# Altium schematic sheet [26] - PWR PMIC.SchDoc
size A2; DocumentNumber: 26; SheetNumber: 26; SheetTotal: 31
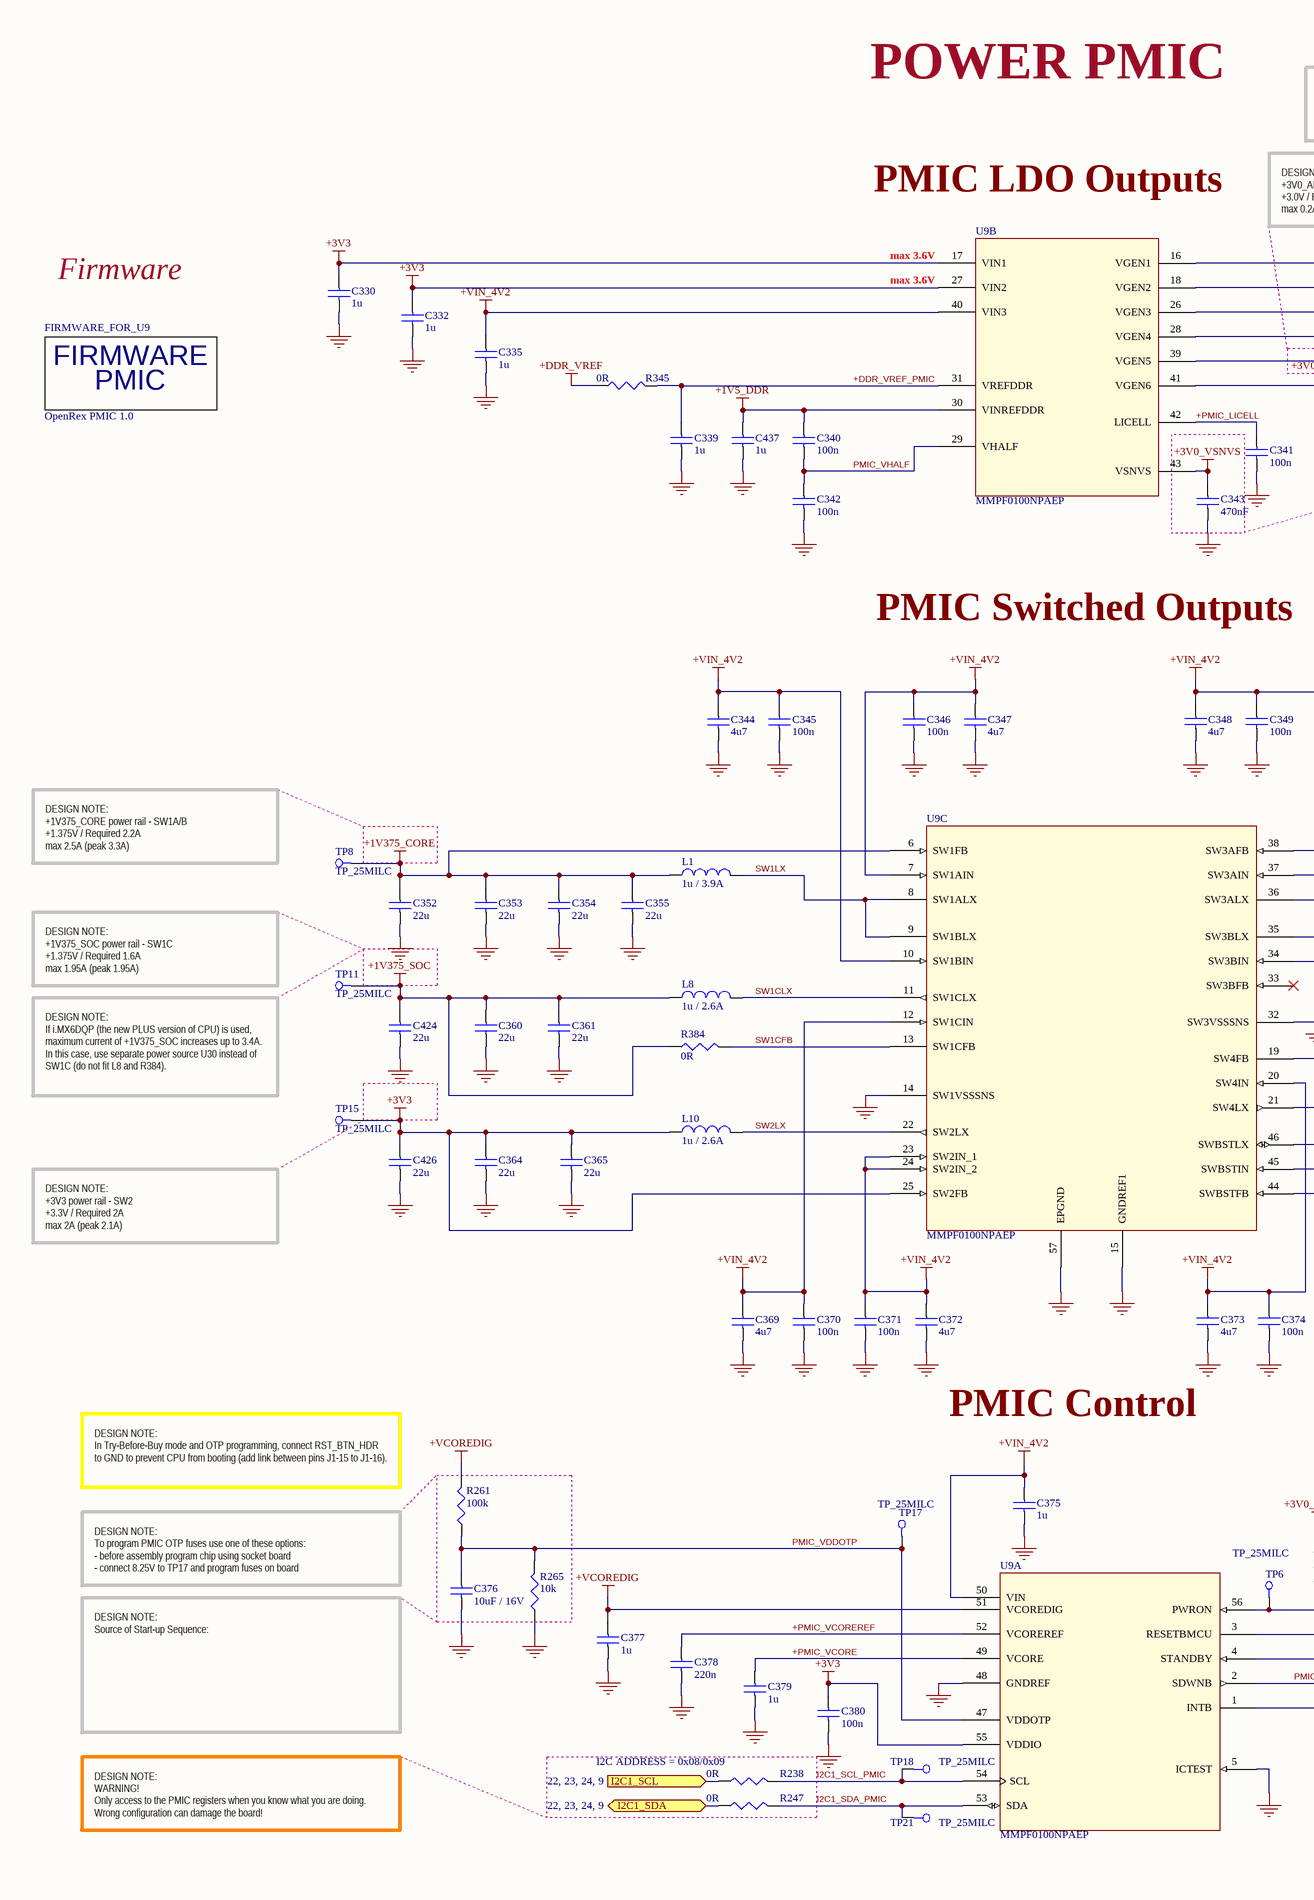
[diagram p0: [26] - PWR PMIC.SchDoc, left]
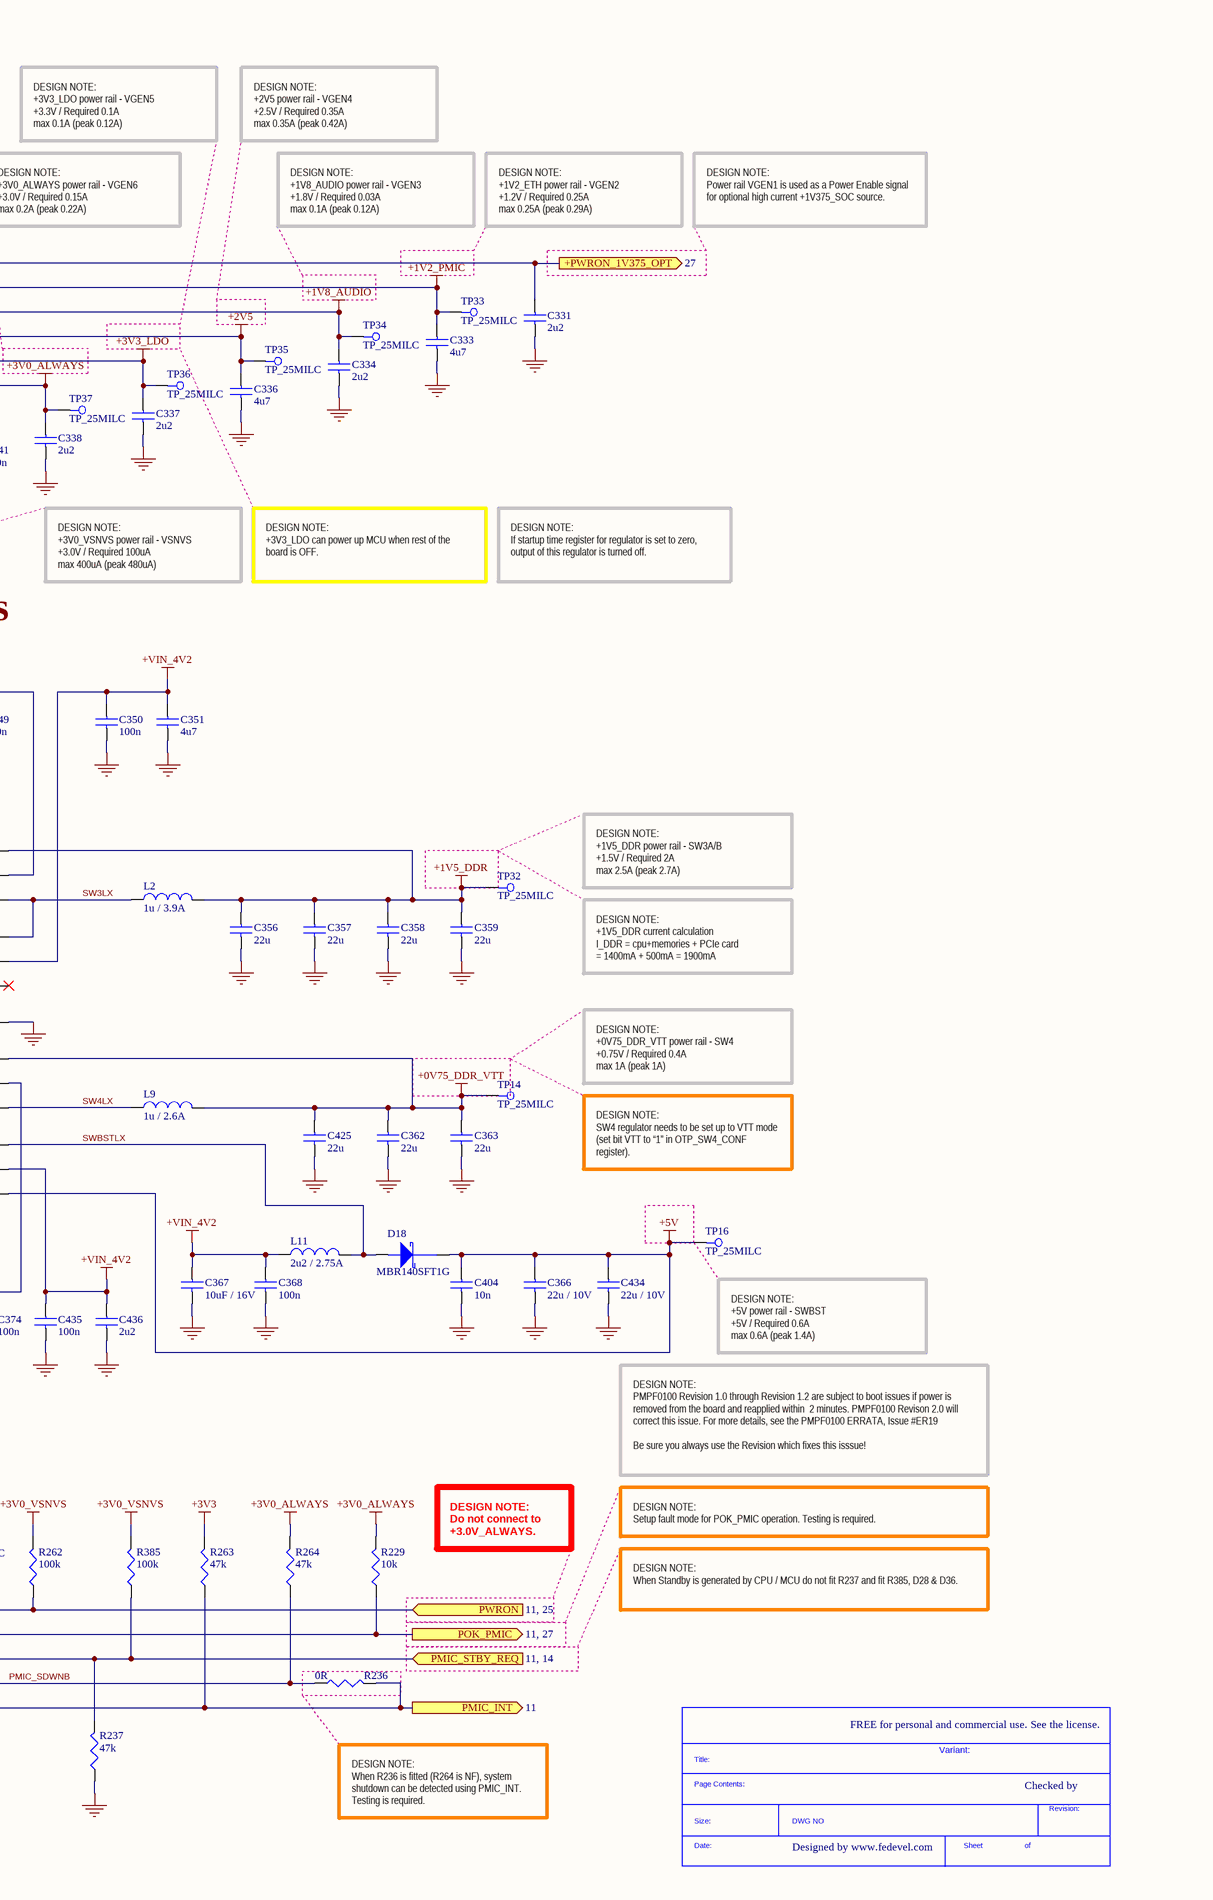
[diagram p1: [26] - PWR PMIC.SchDoc, right]

## Parts
*  SDTitleBlock  (value not drawn)  (graphical)
C330  1u  [C0402]
C331  2u2  [C0402]
C332  1u  [C0402]
C333  4u7  [C0402]
C334  2u2  [C0402]
C335  1u  [C0402]
C336  4u7  [C0402]
C337  2u2  [C0402]
C338  2u2  [C0402]
C339  1u  [C0402]
C340  100n  [C0402]
C341  100n  [C0402]
C342  100n  [C0402]
C343  470nF  [C0402]
C344  4u7  [C0402]
C345  100n  [C0402]
C346  100n  [C0402]
C347  4u7  [C0402]
C348  4u7  [C0402]
C349  100n  [C0402]
C350  100n  [C0402]
C351  4u7  [C0402]
C352  22u  [C0603]
C353  22u  [C0603]
C354  22u  [C0603]
C355  22u  [C0603]
C356  22u  [C0603]
C357  22u  [C0603]
C358  22u  [C0603]
C359  22u  [C0603]
C360  22u  [C0603]
C361  22u  [C0603]
C362  22u  [C0603]
C363  22u  [C0603]
C364  22u  [C0603]
C365  22u  [C0603]
C366  22u / 10V  [C0603]
C367  10uF / 16V  [C0805]
C368  100n  [C0402]
C369  4u7  [C0402]
C370  100n  [C0402]
C371  100n  [C0402]
C372  4u7  [C0402]
C373  4u7  [C0402]
C374  100n  [C0402]
C375  1u  [C0402]
C376  10uF / 16V  [C0805]
C377  1u  [C0402]
C378  220n  [C0402]
C379  1u  [C0402]
C380  100n  [C0402]
C404  10n  [C0402]
C424  22u  [C0603]
C425  22u  [C0603]
C426  22u  [C0603]
C434  22u / 10V  [C0603]
C435  100n  [C0402]
C436  2u2  [C0402]
C437  1u  [C0402]
D18  MBR140SFT1G  [SOD-123FL]
FIRMWARE_FOR_U9  OpenRex PMIC 1.0  (mechanical)
L1  1u / 3.9A  [IHLP_118MILX144MIL]
L2  1u / 3.9A  [IHLP_118MILX144MIL]
L8  1u / 2.6A  [IFSC_79MILX98MIL]
L9  1u / 2.6A  [IFSC_79MILX98MIL]
L10  1u / 2.6A  [IFSC_79MILX98MIL]
L11  2u2 / 2.75A  [IHLP_160MILX175MIL]
R229  10k  [R0402]
R236  0R  [R0402]
R237  47k  [R0402]
R238  0R  [R0402]
R247  0R  [R0402]
R261  100k  [R0402]
R262  100k  [R0402]
R263  47k  [R0402]
R264  47k  [R0402]
R265  10k  [R0402]
R345  0R  [R0402]
R384  0R  [R0402]
R385  100k  [R0402]
TP6  TP_25MILC  [TP_25C]  (no BOM)
TP8  TP_25MILC  [TP_25C]  (no BOM)
TP11  TP_25MILC  [TP_25C]  (no BOM)
TP14  TP_25MILC  [TP_25C]  (no BOM)
TP15  TP_25MILC  [TP_25C]  (no BOM)
TP16  TP_25MILC  [TP_25C]  (no BOM)
TP17  TP_25MILC  [TP_25C]  (no BOM)
TP18  TP_25MILC  [TP_25C]  (no BOM)
TP21  TP_25MILC  [TP_25C]  (no BOM)
TP32  TP_25MILC  [TP_25C]  (no BOM)
TP33  TP_25MILC  [TP_25C]  (no BOM)
TP34  TP_25MILC  [TP_25C]  (no BOM)
TP35  TP_25MILC  [TP_25C]  (no BOM)
TP36  TP_25MILC  [TP_25C]  (no BOM)
TP37  TP_25MILC  [TP_25C]  (no BOM)
U9  MMPF0100NPAEP  [56-VFQFN EP]  (parts A,B,C of 3)

## Blocks framed on the sheet
I2C ADDRESS = 0x08/0x09: R238 R247

## Ports
+PWRON_1V375_OPT (see 27), I2C1_SCL (see 22, 23, 24, 9), I2C1_SDA (bidir, see 22, 23, 24, 9), PMIC_INT (out, see 11), PMIC_STBY_REQ (in, see 11, 14), POK_PMIC (see 11, 27), PWRON (in, see 11, 25)

## Nets
+0V75_DDR_VTT: C362.1 C363.1 C425.1 L9.2 TP14.1 U9.19(SW4FB)
+1V2_PMIC: C333.1 TP33.1 U9.18(VGEN2)
+1V5_DDR: C340.1 C356.1 C357.1 C358.1 C359.1 C437.1 L2.2 TP32.1 U9.30(VINREFDDR) U9.38(SW3AFB)
+1V8_AUDIO: C334.1 TP34.1 U9.26(VGEN3)
+1V375_CORE: C352.1 C353.1 C354.1 C355.1 L1.2 TP8.1 U9.6(SW1FB)
+1V375_SOC: C360.1 C361.1 C424.1 L8.1 R384.1 TP11.1
+2V5: C336.1 TP35.1 U9.28(VGEN4)
+3V0_ALWAYS: C338.1 R229.2 R264.2 TP37.1 U9.41(VGEN6)
+3V0_VSNVS: C343.1 R262.2 R385.2 U9.43(VSNVS)
+3V3: C330.1 C332.1 C364.1 C365.1 C380.1 C426.1 L10.2 R263.2 TP15.1 U9.17(VIN1) U9.25(SW2FB) U9.27(VIN2) U9.55(VDDIO)
+3V3_LDO: C337.1 TP36.1 U9.39(VGEN5)
+5V: C366.1 C404.1 C434.1 D18.1(Cathode) TP16.1 U9.44(SWBSTFB)
+DDR_VREF: R345.1
+VCOREDIG: C377.1 R261.2 U9.51(VCOREDIG)
+VIN_4V2: C335.1 C344.1 C345.1 C346.1 C347.1 C348.1 C349.1 C350.1 C351.1 C367.1 C368.1 C369.1 C370.1 C371.1 C372.1 C373.1 C374.1 C375.1 C435.1 C436.1 L11.1 U9.7(SW1AIN) U9.10(SW1BIN) U9.12(SW1CIN) U9.20(SW4IN) U9.23(SW2IN_1) U9.24(SW2IN_2) U9.34(SW3BIN) U9.37(SW3AIN) U9.40(VIN3) U9.45(SWBSTIN) U9.50(VIN)
GND: C330.2 C331.2 C332.2 C333.2 C334.2 C335.2 C336.2 C337.2 C338.2 C339.2 C341.2 C342.2 C343.2 C344.2 C345.2 C346.2 C347.2 C348.2 C349.2 C350.2 C351.2 C352.2 C353.2 C354.2 C355.2 C356.2 C357.2 C358.2 C359.2 C360.2 C361.2 C362.2 C363.2 C364.2 C365.2 C366.2 C367.2 C368.2 C369.2 C370.2 C371.2 C372.2 C373.2 C374.2 C375.2 C376.2 C377.2 C378.2 C379.2 C380.2 C404.2 C424.2 C425.2 C426.2 C434.2 C435.2 C436.2 C437.2 R237.1 R265.1 U9.5(ICTEST) U9.14(SW1VSSSNS) U9.15(GNDREF1) U9.32(SW3VSSSNS) U9.48(GNDREF) U9.57(EPGND)
+DDR_VREF_PMIC: C339.1 R345.2 U9.31(VREFDDR)
+PMIC_LICELL: C341.1 U9.42(LICELL)
+PMIC_VCORE: C379.1 U9.49(VCORE)
+PMIC_VCOREREF: C378.1 U9.52(VCOREREF)
+PWRON_1V375_OPT: C331.1 U9.16(VGEN1) ; port +PWRON_1V375_OPT
I2C1_SCL: R238.1 ; port I2C1_SCL
I2C1_SCL_PMIC: R238.2 TP18.1 U9.54(SCL)
I2C1_SDA: R247.1 ; port I2C1_SDA
I2C1_SDA_PMIC: R247.2 TP21.1 U9.53(SDA)
PMIC_INT: R236.2 R263.1 U9.1(INTB) ; port PMIC_INT
PMIC_SDWNB: R236.1 R264.1 U9.2(SDWNB)
PMIC_STBY_REQ: R237.2 R385.1 U9.4(STANDBY) ; port PMIC_STBY_REQ
PMIC_VDDOTP: C376.1 R261.1 R265.2 TP17.1 U9.47(VDDOTP)
PMIC_VHALF: C340.2 C342.1 U9.29(VHALF)
POK_PMIC: R229.1 U9.3(RESETBMCU) ; port POK_PMIC
PWRON: R262.1 TP6.1 U9.56(PWRON) ; port PWRON
SW1CFB: R384.2 U9.13(SW1CFB)
SW1CLX: L8.2 U9.11(SW1CLX)
SW1LX: L1.1 U9.8(SW1ALX) U9.9(SW1BLX)
SW2LX: L10.1 U9.22(SW2LX)
SW3LX: L2.1 U9.35(SW3BLX) U9.36(SW3ALX)
SW4LX: L9.1 U9.21(SW4LX)
SWBSTLX: D18.2(Anode) L11.2 U9.46(SWBSTLX)

Not connected (* = marked no-connect by the designer): U9 33(SW3BFB)*

## Notes on the sheet
- POWER PMIC
- DESIGN NOTE:
  +3V3_LDO power rail - VGEN5
  +3.3V / Required 0.1A
  max 0.1A (peak 0.12A)
- DESIGN NOTE:
  +2V5 power rail - VGEN4
  +2.5V / Required 0.35A
  max 0.35A (peak 0.42A)
- PMIC LDO Outputs
- DESIGN NOTE:
  +3V0_ALWAYS power rail - VGEN6
  +3.0V / Required 0.15A
  max 0.2A (peak 0.22A)
- DESIGN NOTE:
  +1V8_AUDIO power rail - VGEN3
  +1.8V / Required 0.03A
  max 0.1A (peak 0.12A)
- DESIGN NOTE:
  +1V2_ETH power rail - VGEN2
  +1.2V / Required 0.25A
  max 0.25A (peak 0.29A)
- (near U9) max 3.6V
- DESIGN NOTE:
  Power rail VGEN1 is used as a Power Enable signal for optional high current +1V375_SOC source.
- Firmware
- DESIGN NOTE:
  +3V0_VSNVS power rail - VSNVS
  +3.0V / Required 100uA
  max 400uA (peak 480uA)
- DESIGN NOTE:
  +3V3_LDO can power up MCU when rest of the board is OFF.
- DESIGN NOTE:
  If startup time register for regulator is set to zero, output of this regulator is turned off.
- PMIC Switched Outputs
- DESIGN NOTE:
  +1V375_CORE power rail - SW1A/B
  +1.375V / Required 2.2A
  max 2.5A (peak 3.3A)
- DESIGN NOTE:
  +1V5_DDR power rail - SW3A/B
  +1.5V / Required 2A
  max 2.5A (peak 2.7A)
- DESIGN NOTE:
  +1V375_SOC power rail - SW1C
  +1.375V / Required 1.6A
  max 1.95A (peak 1.95A)
- DESIGN NOTE:
  +1V5_DDR current calculation
  I_DDR = cpu+memories + PCIe card
  = 1400mA + 500mA = 1900mA
- DESIGN NOTE:
  +0V75_DDR_VTT power rail - SW4
  +0.75V / Required 0.4A
  max 1A (peak 1A)
- DESIGN NOTE:
  If i.MX6DQP (the new PLUS version of CPU) is used, maximum current of +1V375_SOC increases up to 3.4A.
  In this case, use separate power source U30 instead of SW1C (do not fit L8 and R384).
- DESIGN NOTE:
  SW4 regulator needs to be set up to VTT mode (set bit VTT to “1” in OTP_SW4_CONF register).
- DESIGN NOTE:
  +3V3 power rail - SW2
  +3.3V / Required 2A
  max 2A (peak 2.1A)
- DESIGN NOTE:
  +5V power rail - SWBST
  +5V / Required 0.6A
  max 0.6A (peak 1.4A)
- PMIC Control
- DESIGN NOTE:
  In Try-Before-Buy mode and OTP programming, connect RST_BTN_HDR to GND to prevent CPU from booting (add link between pins J1-15 to J1-16).
- DESIGN NOTE:
  PMPF0100 Revision 1.0 through Revision 1.2 are subject to boot issues if power is removed from the board and reapplied within  2 minutes. PMPF0100 Revison 2.0 will correct this issue. For more details, see the PMPF0100 ERRATA, Issue #ER19
  Be sure you always use the Revision which fixes this isssue!
- DESIGN NOTE:
  Do not connect to +3.0V_ALWAYS.
- DESIGN NOTE:
  Setup fault mode for POK_PMIC operation. Testing is required.
- DESIGN NOTE:
  To program PMIC OTP fuses use one of these options:
  - before assembly program chip using socket board
  - connect 8.25V to TP17 and program fuses on board
- DESIGN NOTE:
  When Standby is generated by CPU / MCU do not fit R237 and fit R385, D28 & D36.
- DESIGN NOTE:
  Source of Start-up Sequence:
- FREE for personal and commercial use. See the license.
- Variant:
- Checked by
- DESIGN NOTE:
  WARNING!
  Only access to the PMIC registers when you know what you are doing. Wrong configuration can damage the board!
- DESIGN NOTE:
  When R236 is fitted (R264 is NF), system shutdown can be detected using PMIC_INT. Testing is required.
- Designed by www.fedevel.com
- (in symbol FIRMWARE_OpenRex_PMIC_1.0) FIRMWARE; PMIC
- (in symbol SDTitleBlock) Title:; Page Contents:; Revision:; Size:; DWG NO; Date:; Sheet; of

## Library data of the parts
C330 C332 C335 C339 C375 C377 C379 C437 = C1005X5R1C105K: CAP CER 1.0UF 16V X5R 0402; Manufacturer: TDK Corporation; Capacitance: 1.0µF; Value: 1uF; .Checked PCB: used; Tolerance: ±10%; Category: Capacitors; Supplier Part Number: 445-4978-1-ND; Manufacturer Part Number: C1005X5R1C105K; Operating Temperature: -55°C ~ 85°C; Package / Case: 0402 (1005 Metric); Price 1k [$]: 0.02080; .Checked SCH: used; Voltage - Rated: 16V; Supplier: Digikey; Supplier 1: Digi-Key; Supplier Part Number 1: 445-4978-1-ND; RoHS: RoHS Compliant; Stock 1: 341010; Pricing 1: 1=0.24, 10=0.16, 100=0.064, 250=0.046, 500=0.0328, 1000=0.024 (USD); Temperature Coefficient: X5R; Mounting Type: Surface Mount, MLCC; Applications: General Purpose; Ratings: -; Size / Dimension: 0.039" L x 0.020" W (1.00mm x 0.50mm); Height - Seated (Max): -; Thickness (Max): 0.022" (0.55mm); Lead Spacing: -; Features: -; Packaging: Cut Tape (CT); Lead Style: -; ComponentLink1URL: http://www.tdk.co.jp/tefe02/e412_c.pdf; ComponentLink1Description: http://www.tdk.co.jp/tefe02/e412_c.pdf
C331 C334 C337 C338 C436 = C1005X5R1A225K: CAP CER 2.2UF 10V 10% X5R 0402; Manufacturer: TDK Corporation; Capacitance: 2.2µF; .Checked PCB: used; Supplier 1: Digi-Key; Supplier Part Number 1: 445-7392-1-ND; Manufacturer Part Number: C1005X5R1A225K; RoHS: RoHS Compliant; Category: Capacitors; Stock 1: 22891; Pricing 1: 1=0.42, 10=0.332, 100=0.2, 250=0.15, 500=0.128, 1000=0.1 (USD); Voltage - Rated: 10V; Tolerance: ±10%; Temperature Coefficient: X5R; Mounting Type: Surface Mount, MLCC; Operating Temperature: -55°C ~ 85°C; Applications: General Purpose; Ratings: -; Package / Case: 0402 (1005 Metric); Size / Dimension: 0.039" L x 0.020" W (1.00mm x 0.50mm); Height - Seated (Max): -; Thickness (Max): 0.022" (0.55mm); Lead Spacing: -; Features: -; Packaging: Cut Tape (CT); Lead Style: -; ComponentLink1URL: http://www.tdk.com/pdf/general_B11.pdf; ComponentLink1Description: http://www.tdk.com/pdf/general_B11.pdf; .Checked SCH: used
C333 C336 C344 C347 C348 C351 C369 C372 C373 = C1005X5R1A475M: CAP CER 4.7UF 10V 20% X5R 0402; Manufacturer: TDK Corporation; Capacitance: 4.7µF; .Checked PCB: used; Supplier 1: Digi-Key; Supplier Part Number 1: 445-8023-1-ND; Manufacturer Part Number: C1005X5R1A475M; RoHS: RoHS Compliant; Category: Capacitors; Stock 1: 10140; Pricing 1: 1=0.53, 10=0.415, 100=0.25, 250=0.18752, 500=0.16, 1000=0.125, 5000=0.095 (USD); Voltage - Rated: 10V; Tolerance: ±20%; Temperature Coefficient: X5R; Mounting Type: Surface Mount, MLCC; Operating Temperature: -55°C ~ 85°C; Applications: General Purpose; Ratings: -; Package / Case: 0402 (1005 Metric); Size / Dimension: 0.039" L x 0.020" W (1.00mm x 0.50mm); Height - Seated (Max): -; Thickness (Max): -; Lead Spacing: -; Features: -; Packaging: Cut Tape (CT); Lead Style: -; ComponentLink1URL: http://www.tdk.com/pdf/general_B11.pdf; ComponentLink1Description: http://www.tdk.com/pdf/general_B11.pdf; .Checked SCH: used
C340-C342 C345 C346 C349 C350 C368 C370 C371 C374 C380 C435 = C1005X5R1H104K: CAP CER .10UF 50V X5R 10% 0402; Manufacturer: TDK Corporation; Capacitance: 0.1µF; Value: 100nF; .Checked PCB: used; Category: Capacitors; Supplier Part Number: 445-5942-1-ND; Manufacturer Part Number: C1005X5R1H104K; Operating Temperature: -55°C ~ 85°C; Package / Case: 0402 (1005 Metric); Price 1k [$]: 0.02340; .Checked SCH: used; Voltage - Rated: 50V; Supplier: Digikey; Supplier 1: Digi-Key; Supplier Part Number 1: 445-5942-1-ND; RoHS: RoHS Compliant; Stock 1: 106926; Pricing 1: 1=0.27, 10=0.18, 100=0.072, 250=0.05176, 500=0.0369, 1000=0.027 (USD); Tolerance: ±10%; Temperature Coefficient: X5R; Mounting Type: Surface Mount, MLCC; Applications: General Purpose; Ratings: -; Size / Dimension: 0.039" L x 0.020" W (1.00mm x 0.50mm); Height - Seated (Max): -; Thickness (Max): 0.022" (0.55mm); Lead Spacing: -; Features: -; Packaging: Cut Tape (CT); Lead Style: -; ComponentLink1URL: http://www.tdk.co.jp/tefe02/e412_c.pdf; ComponentLink1Description: http://www.tdk.co.jp/tefe02/e412_c.pdf
C343 = C1005X5R1C474K: CAP CER .47UF 16V X5R 0402; Manufacturer: TDK Corporation; Capacitance: 0.47µF; .Checked PCB: used; Tolerance: ±10%; Category: Capacitors; Supplier Part Number: 445-4976-1-ND; Manufacturer Part Number: C1005X5R1C474K; Operating Temperature: -55°C ~ 85°C; Package / Case: 0402 (1005 Metric); Price 1k [$]: 0.02400; Value: 470nF; .Checked SCH: used; Voltage - Rated: 16V; Supplier: Digikey; Supplier 1: Digi-Key; Supplier Part Number 1: 445-4976-1-ND; RoHS: RoHS Compliant; Stock 1: 141502; Pricing 1: 1=0.24, 10=0.16, 100=0.064, 250=0.046, 500=0.0328, 1000=0.024 (USD); Temperature Coefficient: X5R; Mounting Type: Surface Mount, MLCC; Applications: General Purpose; Ratings: -; Size / Dimension: 0.039" L x 0.020" W (1.00mm x 0.50mm); Height - Seated (Max): -; Thickness (Max): 0.022" (0.55mm); Lead Spacing: -; Features: -; Packaging: Cut Tape (CT); Lead Style: -; ComponentLink1URL: http://www.tdk.co.jp/tefe02/e412_c.pdf; ComponentLink1Description: http://www.tdk.co.jp/tefe02/e412_c.pdf
C352-C363 C424 C425 = GRM188R60G226MEA0L: CAP CER 22UF 4V 20% X5R 0603; Manufacturer: Murata Electronics North America; Capacitance: 22µF; .Checked PCB: used; .Creator: MM; Supplier 1: Digi-Key; Supplier Part Number 1: 490-5526-1-ND; Manufacturer Part Number: GRM188R60G226MEA0L; RoHS: RoHS Compliant; Category: Capacitors; Stock 1: 5760; Pricing 1: 1=0.79, 10=0.663, 50=0.4752, 100=0.4158, 250=0.32672, 500=0.297, 1000=0.2376 (USD); Voltage - Rated: 4V; Tolerance: ±20%; Temperature Coefficient: X5R; Mounting Type: Surface Mount, MLCC; Operating Temperature: -55°C ~ 85°C; Applications: General Purpose; Ratings: -; Package / Case: 0603 (1608 Metric); Size / Dimension: 0.063" L x 0.031" W (1.60mm x 0.80mm); Height - Seated (Max): -; Thickness (Max): 0.035" (0.90mm); Lead Spacing: -; Features: -; Packaging: Cut Tape (CT); Lead Style: -; ComponentLink1URL: http://www.murata.com/products/catalog/pdf/c02e.pdf; ComponentLink1Description: http://www.murata.com/products/catalog/pdf/c02e.pdf; .Checked SCH: used
C364 C365 C426 = C1608X5R0J226M080AC: CAP CER 22UF 6.3V 20% X5R 0603; Manufacturer: TDK Corporation; Capacitance: 22µF; .Creator: MM; Supplier 1: Digi-Key; Manufacturer Part Number: C1608X5R0J226M080AC; RoHS: RoHS Compliant; Category: Capacitors; Stock 1: 593047; Pricing 1: 1=0.39, 10=0.343, 100=0.1714, 250=0.13708, 500=0.12484, 1000=0.1104 (USD); Packaging: Cut Tape (CT); Tolerance: ±20%; Voltage - Rated: 6.3V; Temperature Coefficient: X5R; Mounting Type: Surface Mount, MLCC; Operating Temperature: -55°C ~ 85°C; Applications: General Purpose; Ratings: -; Package / Case: 0603 (1608 Metric); Size / Dimension: 0.063" L x 0.031" W (1.60mm x 0.80mm); Height - Seated (Max): -; Thickness (Max): 0.039" (1.00mm); Lead Spacing: -; Features: -; Lead Style: -; ComponentLink1URL: http://product.tdk.com/en/catalog/datasheets/mlcc_commercial_general_en.pdf; ComponentLink1Description: http://product.tdk.com/en/catalog/datasheets/mlcc_commercial_general_en.pdf; Supplier Part Number 1: 445-8028-1-ND; .Checked PCB: MM; .Checked SCH: MM
C366 C434 = C1608X5R1A226M080AC: CAP CER 22UF 10V X5R 0603; Manufacturer: TDK Corporation; Capacitance: 22µF; Tolerance: ±20%; .Creator: MM; Supplier 1: Digi-Key; Manufacturer Part Number: C1608X5R1A226M080AC; RoHS: RoHS Compliant; Category: Capacitors; Stock 1: 405620; Pricing 1: 1=0.49, 10=0.469, 100=0.2275, 250=0.189, 500=0.1715, 1000=0.1575 (USD); Packaging: Cut Tape (CT); Voltage - Rated: 10V; Temperature Coefficient: X5R; Mounting Type: Surface Mount, MLCC; Operating Temperature: -55°C ~ 85°C; Applications: General Purpose; Ratings: -; Package / Case: 0603 (1608 Metric); Size / Dimension: 0.063" L x 0.031" W (1.60mm x 0.80mm); Height - Seated (Max): -; Thickness (Max): 0.035" (0.90mm); Lead Spacing: -; Features: -; Lead Style: -; ComponentLink1URL: http://product.tdk.com/en/catalog/datasheets/mlcc_commercial_general_en.pdf; ComponentLink1Description: http://product.tdk.com/en/catalog/datasheets/mlcc_commercial_general_en.pdf; Supplier Part Number 1: 445-9077-1-ND; .Checked SCH: MM; .Checked PCB: MM
C367 C376 = C2012X5R1C106M: CAP CER 10UF 16V 20% X5R 0805; Manufacturer: TDK Corporation; Manufacturer Part Number: C2012X5R1C106M/1.25; Capacitance: 10µF; .Checked PCB: used; Supplier 1: Digi-Key; Supplier Part Number 1: 445-4115-1-ND; RoHS: RoHS Compliant; Category: Capacitors; Stock 1: 66161; Pricing 1: 1=0.45, 10=0.357, 100=0.215, 250=0.16124, 500=0.1376, 1000=0.1075 (USD); Voltage - Rated: 16V; Tolerance: ±20%; Temperature Coefficient: X5R; Mounting Type: Surface Mount, MLCC; Operating Temperature: -55°C ~ 85°C; Applications: General Purpose; Ratings: -; Package / Case: 0805 (2012 Metric); Size / Dimension: 0.079" L x 0.049" W (2.00mm x 1.25mm); Height - Seated (Max): -; Thickness (Max): 0.039" (1.00mm); Lead Spacing: -; Features: -; Packaging: Cut Tape (CT); Lead Style: -; ComponentLink1URL: http://www.tdk.com/pdf/general_B11.pdf; ComponentLink1Description: http://www.tdk.com/pdf/general_B11.pdf; .Checked SCH: used
C378 = C1005X5R1E224M: CAP CER .22UF 25V X5R 20% 0402; Manufacturer: TDK Corporation; Capacitance: 0.22µF; Value: 220nF; .Checked PCB: used; Category: Capacitors; Supplier Part Number: 445-5945-1-ND; Manufacturer Part Number: C1005X5R1E224M; Operating Temperature: -55°C ~ 85°C; Package / Case: 0402 (1005 Metric); Price 1k [$]: 0.02600; .Checked SCH: used; Voltage - Rated: 25V; Supplier: Digikey; Supplier 1: Digi-Key; Supplier Part Number 1: 445-5945-1-ND; RoHS: RoHS Compliant; Stock 1: 54593; Pricing 1: 1=0.3, 10=0.2, 100=0.08, 250=0.05752, 500=0.041, 1000=0.03 (USD); Tolerance: ±20%; Temperature Coefficient: X5R; Mounting Type: Surface Mount, MLCC; Applications: General Purpose; Ratings: -; Size / Dimension: 0.039" L x 0.020" W (1.00mm x 0.50mm); Height - Seated (Max): -; Thickness (Max): 0.022" (0.55mm); Lead Spacing: -; Features: -; Packaging: Cut Tape (CT); Lead Style: -; ComponentLink1URL: http://www.tdk.co.jp/tefe02/e412_c.pdf; ComponentLink1Description: http://www.tdk.co.jp/tefe02/e412_c.pdf
C404 = C1005X7R1H103K: CAP CER 10000PF 50V 10% X7R 0402; Manufacturer: TDK Corporation; Value: 10nF; .Checked PCB: used; Capacitance: 10000pF; Category: Capacitors; Supplier Part Number: 445-6850-1-ND; Manufacturer Part Number: C1005X7R1H103K; Operating Temperature: -55°C ~ 125°C; Package / Case: 0402 (1005 Metric); Price 1k [$]: 0.01625; .Checked SCH: used; Voltage - Rated: 50V; Supplier: Digikey; Supplier 1: Digi-Key; Supplier Part Number 1: 445-6850-1-ND; RoHS: RoHS Compliant; Stock 1: 3901; Pricing 1: 1=0.2, 10=0.125, 100=0.045, 250=0.03252, 500=0.024, 1000=0.01625 (USD); Tolerance: ±10%; Temperature Coefficient: X7R; Mounting Type: Surface Mount, MLCC; Applications: General Purpose; Ratings: -; Size / Dimension: 0.039" L x 0.020" W (1.00mm x 0.50mm); Height - Seated (Max): -; Thickness (Max): 0.022" (0.55mm); Lead Spacing: -; Features: -; Packaging: Cut Tape (CT); Lead Style: -; ComponentLink1URL: http://www.tdk.co.jp/tefe02/e412_c.pdf; ComponentLink1Description: http://www.tdk.co.jp/tefe02/e412_c.pdf
D18 = MBR140SFT1G: DIODE SCHOTTKY 40V 1A SOD123L; Manufacturer: ON Semiconductor; Voltage - Forward (Vf) (Max) @ If: 550mV @ 1A; Speed: Fast Recovery =< 500ns, > 200mA (Io); Current - Reverse Leakage @ Vr: 500µA @ 40V; .Creator: MM; Supplier 1: Digi-Key; Manufacturer Part Number: MBR140SFT1G; RoHS: RoHS Compliant; Category: Discrete Semiconductor Products; Stock 1: 9727; Pricing 1: 1=0.47, 10=0.333, 25=0.274, 100=0.2188, 250=0.1594, 500=0.12944, 1000=0.0995 (USD); Packaging: Cut Tape (CT); Diode Type: Schottky; Voltage - DC Reverse (Vr) (Max): 40V; Current - Average Rectified (Io): 1A; Reverse Recovery Time (trr): -; Capacitance @ Vr, F: -; Mounting Type: Surface Mount; Package / Case: SOD-123F; Supplier Device Package: SOD-123L; Operating Temperature - Junction: -55°C ~ 125°C; ComponentLink1URL: http://www.onsemi.com/pub_link/Collateral/MBR140SFT1-D.PDF; ComponentLink1Description: http://www.onsemi.com/pub_link/Collateral/MBR140SFT1-D.PDF; Supplier Part Number 1: MBR140SFT1GOSCT-ND; .Checked PCB: MM; .Checked SCH: MM
FIRMWARE_FOR_U9 = FIRMWARE_OpenRex_PMIC_1.0: .Creator: MM; Category: Firmware; .Checked SCH: MM
L1 L2 = IHLP1212AEER1R0M11: FIXED IND 1UH 3.9A 33 MOHM SMD; Manufacturer: Vishay Dale; Type: Molded; Inductance: 1µH; Tolerance: ±20%; Current - Saturation: 5.3A; Shielding: Shielded; DC Resistance (DCR): 33 mOhm Max; Frequency - Test: 100kHz; .Creator: MM; Supplier 1: Digi-Key; Manufacturer Part Number: IHLP1212AEER1R0M11; RoHS: RoHS Compliant; Category: Inductors, Coils, Chokes; Stock 1: 3480; Pricing 1: 1=1.44, 10=1.35, 100=1.026, 500=0.828, 1000=0.756 (USD); Packaging: Cut Tape (CT); Material - Core: -; Current Rating: 3.9A; Q @ Freq: -; Frequency - Self Resonant: -; Operating Temperature: -55°C ~ 125°C; Mounting Type: Surface Mount; Package / Case: Nonstandard; Size / Dimension: 0.144" L x 0.118" W (3.65mm x 3.00mm); Height - Seated (Max): 0.047" (1.20mm); Supplier Device Package: -; ComponentLink1URL: http://www.vishay.com/docs/34300/lp12ae11.pdf; ComponentLink1Description: http://www.vishay.com/docs/34300/lp12ae11.pdf; Supplier Part Number 1: 541-1327-1-ND; .Checked PCB: MM; .Checked SCH: MM
L8-L10 = IFSC1008ABER1R0M01: FIXED IND 1UH 2.6A 43 MOHM SMD; Manufacturer: Vishay Dale; Inductance: 1µH; Tolerance: ±20%; Current - Saturation: 2.7A; Shielding: Shielded; DC Resistance (DCR): 43 mOhm Max; Frequency - Test: 100kHz; .Creator: MM; Supplier 1: Digi-Key; Manufacturer Part Number: IFSC1008ABER1R0M01; RoHS: RoHS Compliant; Category: Inductors, Coils, Chokes; Stock 1: 46148; Pricing 1: 1=0.62, 10=0.501, 100=0.4175, 500=0.334, 1000=0.3006 (USD); Packaging: Cut Tape (CT); Type: -; Material - Core: -; Current Rating: 2.6A; Q @ Freq: -; Frequency - Self Resonant: -; Operating Temperature: -55°C ~ 125°C; Mounting Type: Surface Mount; Package / Case: Nonstandard; Size / Dimension: 0.098" L x 0.079" W (2.50mm x 2.00mm); Height - Seated (Max): 0.047" (1.20mm); Supplier Device Package: -; ComponentLink1URL: http://www.vishay.com/docs/34294/s108ab01.pdf; ComponentLink1Description: http://www.vishay.com/docs/34294/s108ab01.pdf; Supplier Part Number 1: 541-1388-1-ND; .Checked PCB: MM; .Checked SCH: MM
L11 = IHLP1616ABER2R2M11: FIXED IND 2.2UH 2.75A 83.5 MOHM; Manufacturer: Vishay Dale; Type: Molded; Inductance: 2.2µH; Tolerance: ±20%; Current - Saturation: 3A; Shielding: Shielded; DC Resistance (DCR): 83.5 mOhm Max; Frequency - Self Resonant: 49MHz; Frequency - Test: 100kHz; .Creator: MM; Supplier 1: Digi-Key; Manufacturer Part Number: IHLP1616ABER2R2M11; RoHS: RoHS Compliant; Category: Inductors, Coils, Chokes; Stock 1: 11070; Pricing 1: 1=2.63, 10=2.45, 100=1.82, 500=1.54, 1000=1.435 (USD); Packaging: Cut Tape (CT); Material - Core: -; Current Rating: 2.75A; Q @ Freq: -; Operating Temperature: -55°C ~ 125°C; Mounting Type: Surface Mount; Package / Case: Nonstandard; Size / Dimension: 0.175" L x 0.160" W (4.45mm x 4.06mm); Height - Seated (Max): 0.047" (1.20mm); Supplier Device Package: -; ComponentLink1URL: http://media.digikey.com/pdf/Data%20Sheets/Vishay%20Dale%20PDFs/IHLP-1616-11.pdf; ComponentLink1Description: http://media.digikey.com/pdf/Data%20Sheets/Vishay%20Dale%20PDFs/IHLP-1616-11.pdf; Supplier Part Number 1: 541-1045-1-ND; .Checked PCB: MM; .Checked SCH: MM
R229 R265 = RC0402FR-0710KL: RES 10.0K OHM 1/16W 1% 0402 SMD; Manufacturer: Yageo; Power (Watts): 0.063W, 1/16W; .Checked PCB: used; Temperature Coefficient: ±100ppm/°C; Category: Resistors; Supplier Part Number: 311-10.0KLRCT-ND; Manufacturer Part Number: RC0402FR-0710KL; Package / Case: 0402 (1005 Metric); Price 1k [$]: 0.01421; Resistance (Ohms): 10K; Tolerance: ±1%; Value: 10k; .Checked SCH: used; Supplier: Digikey; Supplier 1: Digi-Key; Supplier Part Number 1: 311-10.0KLRCT-ND; RoHS: RoHS Compliant; Stock 1: 2916495; Pricing 1: 10=0.014, 50=0.0104, 100=0.0079, 250=0.00584, 500=0.00432, 1000=0.00288 (USD); Composition: Thick Film; Features: -; Size / Dimension: 0.039" L x 0.020" W (1.00mm x 0.50mm); Height: 0.016" (0.40mm); Number of Terminations: 2; Packaging: Cut Tape (CT); ComponentLink1URL: http://www.yageo.com/documents/recent/PYu-RC0402_51_RoHS_L_6.pdf; ComponentLink1Description: http://www.yageo.com/documents/recent/PYu-RC0402_51_RoHS_L_6.pdf
R236 R238 R247 R345 R384 = RC0402JR-070RL: RES 0.0 OHM 1/16W 0402 SMD; Manufacturer: Yageo; Resistance (Ohms): 0.0; Power (Watts): 0.063W, 1/16W; Tolerance: Jumper; .Checked PCB: used; Category: Resistors; Supplier Part Number: 311-0.0JRCT-ND; Manufacturer Part Number: RC0402JR-070RL; Package / Case: 0402 (1005 Metric); Price 1k [$]: 0.01389; Value: 0R; .Checked SCH: used; Supplier: Digikey; Supplier 1: Digi-Key; Supplier Part Number 1: 311-0.0JRCT-ND; RoHS: RoHS Compliant; Stock 1: 1106330; Pricing 1: 10=0.012, 50=0.009, 100=0.0069, 250=0.00512, 500=0.0038, 1000=0.00253 (USD); Composition: Thick Film; Features: -; Temperature Coefficient: -; Size / Dimension: 0.039" L x 0.020" W (1.00mm x 0.50mm); Height: 0.016" (0.40mm); Number of Terminations: 2; Packaging: Cut Tape (CT); ComponentLink1URL: http://www.yageo.com/documents/recent/PYu-RC0402_51_RoHS_L_6.pdf; ComponentLink1Description: http://www.yageo.com/documents/recent/PYu-RC0402_51_RoHS_L_6.pdf
R237 R263 R264 = RC0402FR-0747KL: RES 47.0K OHM 1/16W 1% 0402 SMD; Manufacturer: Yageo; Power (Watts): 0.063W, 1/16W; .Checked PCB: used; Temperature Coefficient: ±100ppm/°C; Category: Resistors; Supplier Part Number: 311-47.0KLRCT-ND; Manufacturer Part Number: RC0402FR-0747KL; Package / Case: 0402 (1005 Metric); Price 1k [$]: 0.01421; Resistance (Ohms): 47K; Tolerance: ±1%; Value: 47k; .Checked SCH: used; Supplier: Digikey; Supplier 1: Digi-Key; Supplier Part Number 1: 311-47.0KLRCT-ND; RoHS: RoHS Compliant; Stock 1: 1227580; Pricing 1: 10=0.014, 50=0.0104, 100=0.0079, 250=0.00584, 500=0.00432, 1000=0.00288 (USD); Composition: Thick Film; Features: -; Size / Dimension: 0.039" L x 0.020" W (1.00mm x 0.50mm); Height: 0.016" (0.40mm); Number of Terminations: 2; Packaging: Cut Tape (CT); ComponentLink1URL: http://www.yageo.com/documents/recent/PYu-RC0402_51_RoHS_L_6.pdf; ComponentLink1Description: http://www.yageo.com/documents/recent/PYu-RC0402_51_RoHS_L_6.pdf
R261 R262 R385 = RMCF0402FT100K: RES 100K OHM 1/16W 1% 0402 SMD; Manufacturer: Stackpole Electronics Inc; Power (Watts): 0.063W, 1/16W; .Checked PCB: used; Temperature Coefficient: ±100ppm/°C; Category: Resistors; Supplier Part Number: RMCF0402FT100KCT-ND; Manufacturer Part Number: RMCF0402FT100K; Package / Case: 0402 (1005 Metric); Price 1k [$]: 0.00384; Resistance (Ohms): 100K; Tolerance: ±1%; Value: 100k; .Checked SCH: used; Supplier: Digikey; Supplier 1: Digi-Key; Supplier Part Number 1: RMCF0402FT100KCT-ND; RoHS: RoHS Compliant; Stock 1: 95; Pricing 1: 1=0.04, 10=0.025, 50=0.0138, 100=0.0105, 250=0.0078, 500=0.00576, 1000=0.00384 (USD); Composition: Thick Film; Features: -; Size / Dimension: 0.039" L x 0.020" W (1.00mm x 0.50mm); Height: 0.016" (0.40mm); Number of Terminations: 2; Packaging: Cut Tape (CT); ComponentLink1URL: http://www.seielect.com/Catalog/SEI-RMCF.pdf; ComponentLink1Description: http://www.seielect.com/Catalog/SEI-RMCF.pdf
TP6 TP8 TP11 TP14-TP18 TP21 TP32-TP37 = TP_25MILC: Test Point 25mil
U9 = MMPF0100NPAEP: IC PWR MGMT I.MX6 56QFN; Manufacturer: Freescale Semiconductor; Voltage - Input: 2.8 V ~ 4.5 V; Number of Outputs: 12; Voltage - Output: Multiple; .Creator: MM; Supplier 1: Digi-Key; Manufacturer Part Number: MMPF0100NPAEP; RoHS: RoHS Compliant; Category: Integrated Circuits (ICs); Stock 1: 0; Pricing 1: 260=4.017 (USD); Packaging: Tray; Applications: Converter, i.MX6; Operating Temperature: -40°C ~ 85°C; Mounting Type: Surface Mount; Package / Case: 56-VFQFN Exposed Pad; Supplier Device Package: 56-QFN (8x8); ComponentLink1URL: http://cache.freescale.com/files/analog/doc/data_sheet/MMPF0100.pdf; ComponentLink1Description: http://cache.freescale.com/files/analog/doc/data_sheet/MMPF0100.pdf; Supplier Part Number 1: MMPF0100NPAEP-ND; .Checked PCB: MM; .Checked SCH: MM